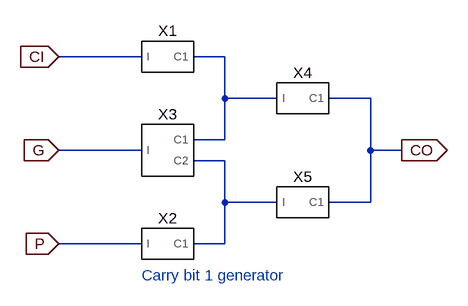
[diagram p0: schematic cla1.asc]
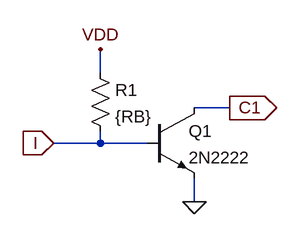
[diagram p1: sub-circuit iilg1.asc]
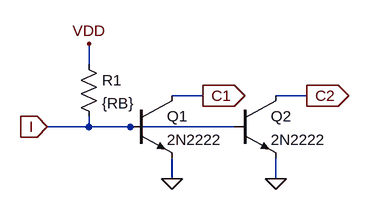
[diagram p2: sub-circuit iilg2.asc]
cla1.asc, the LTspice schematic file:
Version 4
SHEET 1 1856 1728
WIRE 336 192 208 192
WIRE 464 192 416 192
WIRE 464 256 464 192
WIRE 544 256 464 256
WIRE 688 256 624 256
WIRE 464 320 464 256
WIRE 464 320 416 320
WIRE 336 336 208 336
WIRE 688 336 688 256
WIRE 736 336 688 336
WIRE 464 352 416 352
WIRE 464 416 464 352
WIRE 544 416 464 416
WIRE 688 416 688 336
WIRE 688 416 624 416
WIRE 336 480 208 480
WIRE 464 480 464 416
WIRE 464 480 416 480
FLAG 208 192 CI
IOPIN 208 192 In
FLAG 208 336 G
IOPIN 208 336 In
FLAG 208 480 P
IOPIN 208 480 In
FLAG 736 336 CO
IOPIN 736 336 Out
SYMBOL iilg1 368 192 R0
SYMATTR InstName X1
SYMBOL iilg1 368 480 R0
SYMATTR InstName X2
SYMBOL iilg2 368 336 R0
SYMATTR InstName X3
SYMBOL iilg1 576 256 R0
SYMATTR InstName X4
SYMBOL iilg1 576 416 R0
SYMATTR InstName X5
TEXT 336 528 Left 2 ;Carry bit 1 generator

iilg1.asc, the sub-circuit schematic file:
Version 4
SHEET 1 880 680
WIRE 384 240 384 208
WIRE 560 288 512 288
WIRE 384 336 384 320
WIRE 384 336 320 336
WIRE 448 336 384 336
WIRE 512 416 512 384
FLAG 512 416 0
FLAG 384 208 VDD
FLAG 320 336 I
IOPIN 320 336 In
FLAG 560 288 C1
IOPIN 560 288 Out
SYMBOL npn 448 288 R0
SYMATTR InstName Q1
SYMATTR Value 2N2222
SYMBOL res 368 224 R0
SYMATTR InstName R1
SYMATTR Value {RB}

iilg2.asc, the sub-circuit schematic file:
Version 4
SHEET 1 880 680
WIRE 384 240 384 208
WIRE 560 288 512 288
WIRE 720 288 672 288
WIRE 384 336 384 320
WIRE 384 336 320 336
WIRE 448 336 384 336
WIRE 608 336 448 336
WIRE 512 416 512 384
WIRE 672 416 672 384
FLAG 384 208 VDD
FLAG 320 336 I
IOPIN 320 336 In
FLAG 512 416 0
FLAG 560 288 C1
IOPIN 560 288 Out
FLAG 672 416 0
FLAG 720 288 C2
IOPIN 720 288 Out
SYMBOL npn 448 288 R0
SYMATTR InstName Q1
SYMATTR Value 2N2222
SYMBOL res 368 224 R0
SYMATTR InstName R1
SYMATTR Value {RB}
SYMBOL npn 608 288 R0
SYMATTR InstName Q2
SYMATTR Value 2N2222

The netlist it stands for:
* cla1.asc
XX1 CI N001 iilg1
XX2 P N002 iilg1
XX3 G N001 N002 iilg2
XX4 N001 CO iilg1
XX5 N002 CO iilg1

* block symbol definitions
.subckt iilg1 I C1
Q1 C1 I 0 0 2N2222
R1 VDD I {RB}
.ends iilg1

.subckt iilg2 I C1 C2
Q1 C1 I 0 0 2N2222
R1 VDD I {RB}
Q2 C2 I 0 0 2N2222
.ends iilg2

.model NPN NPN
.model PNP PNP
.lib standard.bjt
* Carry bit 1 generator
.backanno
.end